# EAGLE design UmnitsaControl_v2.0 (EAGLE 9.3.0)
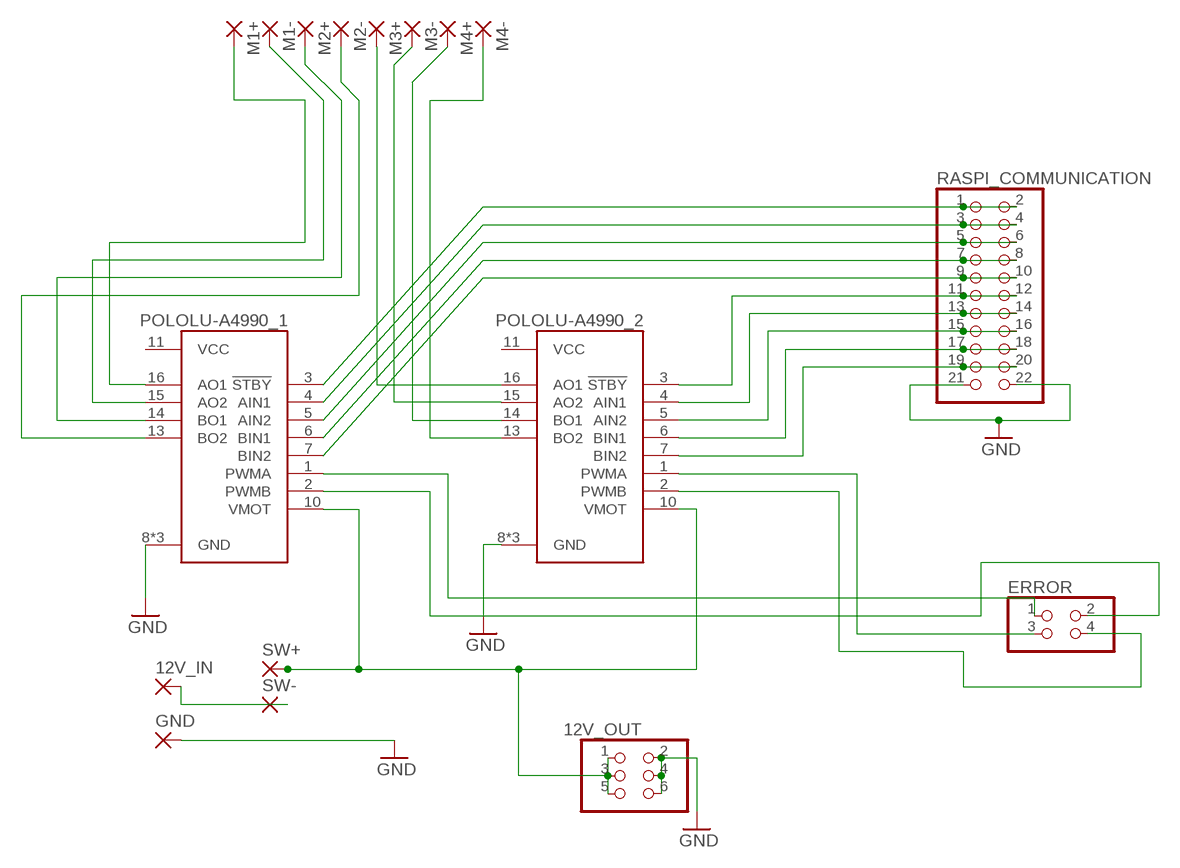
[diagram p0: schematic, sheet 1]

## Parts
12V_IN  3,81/1,4  [3,81/1,4]
12V_OUT  PINHD-2X3  [2X03]
ERROR  PINHD-2X2  [2X02]
GND  3,81/1,4  [3,81/1,4]
M1+  3,81/1,4  [3,81/1,4]
M1-  3,81/1,4  [3,81/1,4]
M2+  3,81/1,4  [3,81/1,4]
M2-  3,81/1,4  [3,81/1,4]
M3+  3,81/1,4  [3,81/1,4]
M3-  3,81/1,4  [3,81/1,4]
M4+  3,81/1,4  [3,81/1,4]
M4-  3,81/1,4  [3,81/1,4]
POLOLU-A4990_1  POLOLU-713  [SHIELD_POLOLU-713]
POLOLU-A4990_2  POLOLU-713  [SHIELD_POLOLU-713]
RASPI_COMMUNICATION  PINHD-2X11  [2X11]
SW+  2,54/1,0  [2,54/1,0]
SW-  2,54/1,0  [2,54/1,0]

## Nets
GND [Power]: 12V_OUT.2 12V_OUT.4 12V_OUT.6 GND.1(P) POLOLU-A4990_1.8(GND) POLOLU-A4990_1.9(GND) POLOLU-A4990_1.12(GND) POLOLU-A4990_2.8(GND) POLOLU-A4990_2.9(GND) POLOLU-A4990_2.12(GND) RASPI_COMMUNICATION.21 RASPI_COMMUNICATION.22
N$1 [Motor]: M1+.1(P) POLOLU-A4990_1.16(AO1)
N$2 [Motor]: M1-.1(P) POLOLU-A4990_1.15(AO2)
N$3: 12V_IN.1(P) SW-.1(P)
N$4 [Motor]: M2+.1(P) POLOLU-A4990_1.14(BO1)
N$5 [Motor]: M2-.1(P) POLOLU-A4990_1.13(BO2)
N$6 [Motor]: M3+.1(P) POLOLU-A4990_2.16(AO1)
N$7 [Motor]: M3-.1(P) POLOLU-A4990_2.15(AO2)
N$8 [Motor]: M4+.1(P) POLOLU-A4990_2.14(BO1)
N$9 [Motor]: M4-.1(P) POLOLU-A4990_2.13(BO2)
N$10: POLOLU-A4990_2.3(!STBY) RASPI_COMMUNICATION.11 RASPI_COMMUNICATION.12
N$11: POLOLU-A4990_2.7(BIN2) RASPI_COMMUNICATION.19 RASPI_COMMUNICATION.20
N$12: POLOLU-A4990_2.6(BIN1) RASPI_COMMUNICATION.17 RASPI_COMMUNICATION.18
N$13: POLOLU-A4990_2.5(AIN2) RASPI_COMMUNICATION.15 RASPI_COMMUNICATION.16
N$14: POLOLU-A4990_2.4(AIN1) RASPI_COMMUNICATION.13 RASPI_COMMUNICATION.14
N$15: POLOLU-A4990_1.3(!STBY) RASPI_COMMUNICATION.1 RASPI_COMMUNICATION.2
N$16: POLOLU-A4990_1.4(AIN1) RASPI_COMMUNICATION.3 RASPI_COMMUNICATION.4
N$17: POLOLU-A4990_1.5(AIN2) RASPI_COMMUNICATION.5 RASPI_COMMUNICATION.6
N$18: POLOLU-A4990_1.6(BIN1) RASPI_COMMUNICATION.7 RASPI_COMMUNICATION.8
N$19: POLOLU-A4990_1.7(BIN2) RASPI_COMMUNICATION.9 RASPI_COMMUNICATION.10
N$21: ERROR.3 POLOLU-A4990_2.1(PWMA)
N$23: ERROR.4 POLOLU-A4990_2.2(PWMB)
N$25: ERROR.1 POLOLU-A4990_1.1(PWMA)
N$26: ERROR.2 POLOLU-A4990_1.2(PWMB)
N$28 [Low Power]: 12V_OUT.1 12V_OUT.3 12V_OUT.5 POLOLU-A4990_1.10(VMOT) POLOLU-A4990_2.10(VMOT) SW+.1(P)

## Power pins joined to a net without a drawn wire
VCC: POLOLU-A4990_1.11(VCC) POLOLU-A4990_2.11(VCC)

## Library data of the parts
12V_IN GND M1+ M1- M2+ M2- M3+ M3- M4+ M4- = wirepad:3,81/1,4: THROUGH-HOLE PAD
12V_OUT = pinhead:PINHD-2X3: PIN HEADER
ERROR = pinhead:PINHD-2X2: PIN HEADER
POLOLU-A4990_1 POLOLU-A4990_2 = POLOLU-A4990:POLOLU-713: DC-motor driver; IC: TB6612FNG; 100kHz; 1A; Uin mot: 4.5; AVAILABILITY: Unavailable; DESCRIPTION: DC-motor driver; IC: TB6612FNG; 100kHz; 1A; Uin mot: 4.5; MF: Pololu; MP: POLOLU-713; PACKAGE: None; PRICE: None
RASPI_COMMUNICATION = pinhead:PINHD-2X11: PIN HEADER
SW+ SW- = wirepad:2,54/1,0: THROUGH-HOLE PAD

## Net classes
0 default: width 0.406 mm, clearance 0.406 mm
1 Power: width 3.048 mm, clearance 0.406 mm
2 Motor: width 1.016 mm, clearance 0.406 mm
3 Low Power: width 2.54 mm, clearance 0.406 mm

## Board
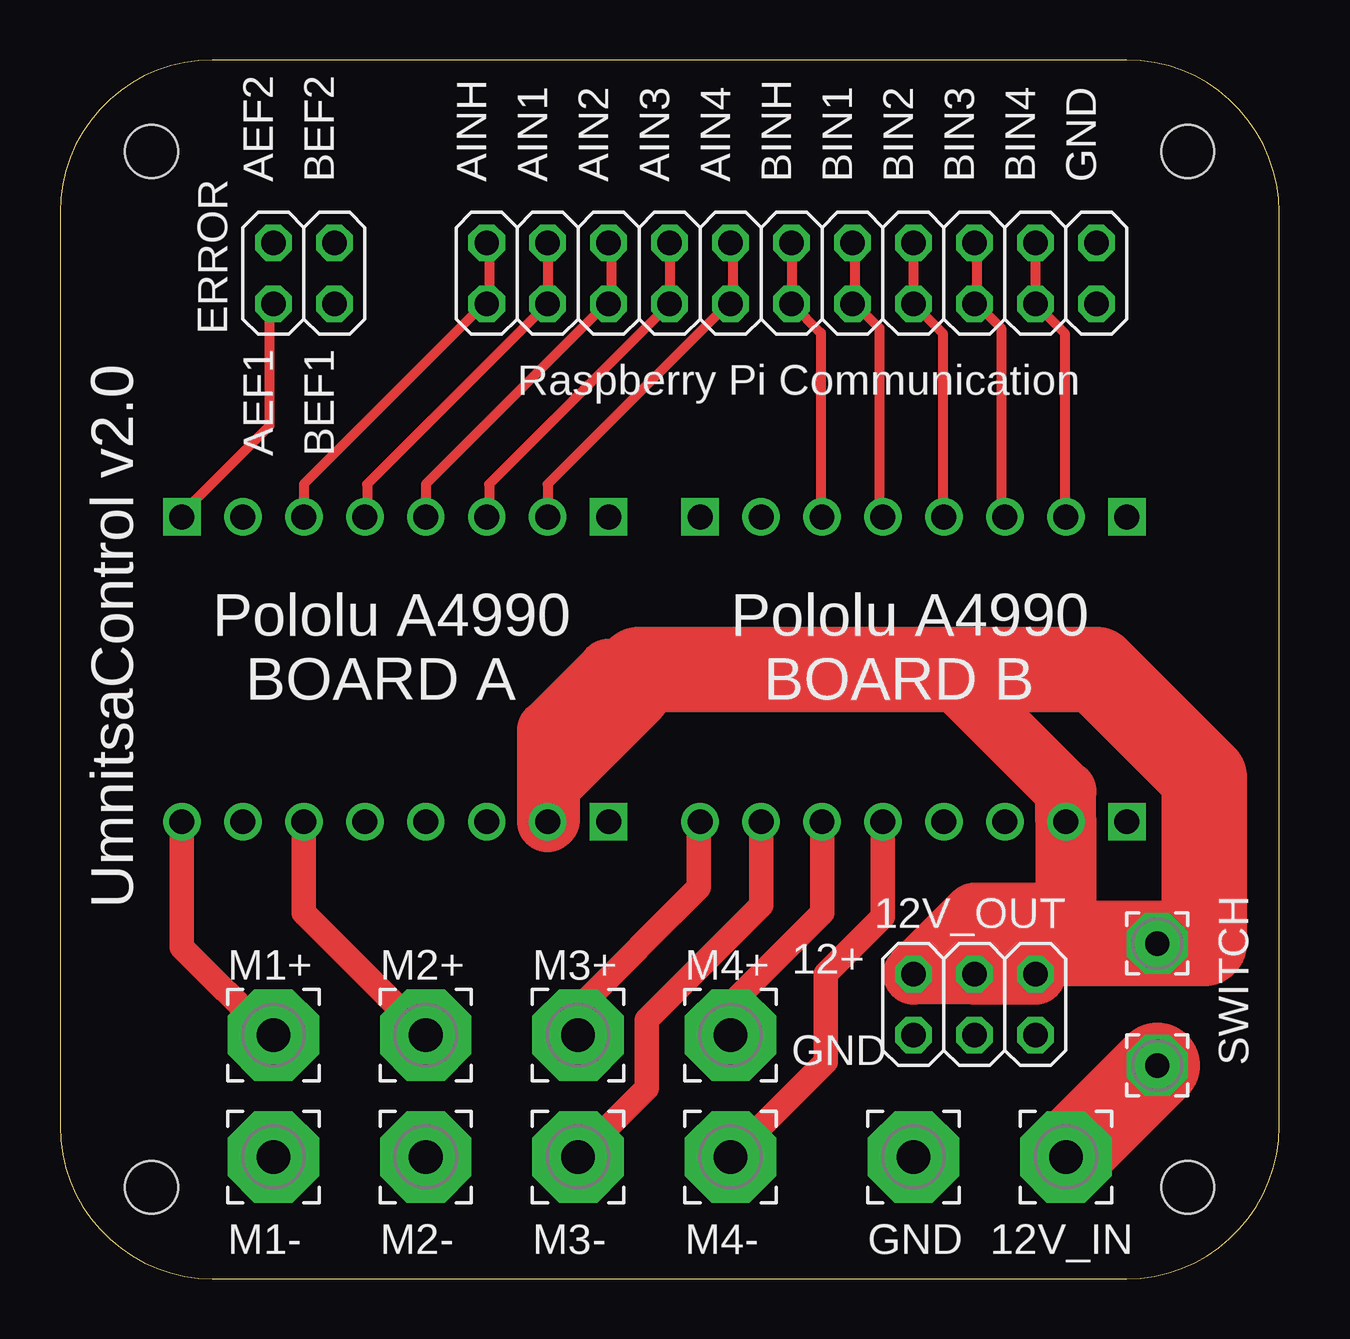
[diagram p1: board, top side]
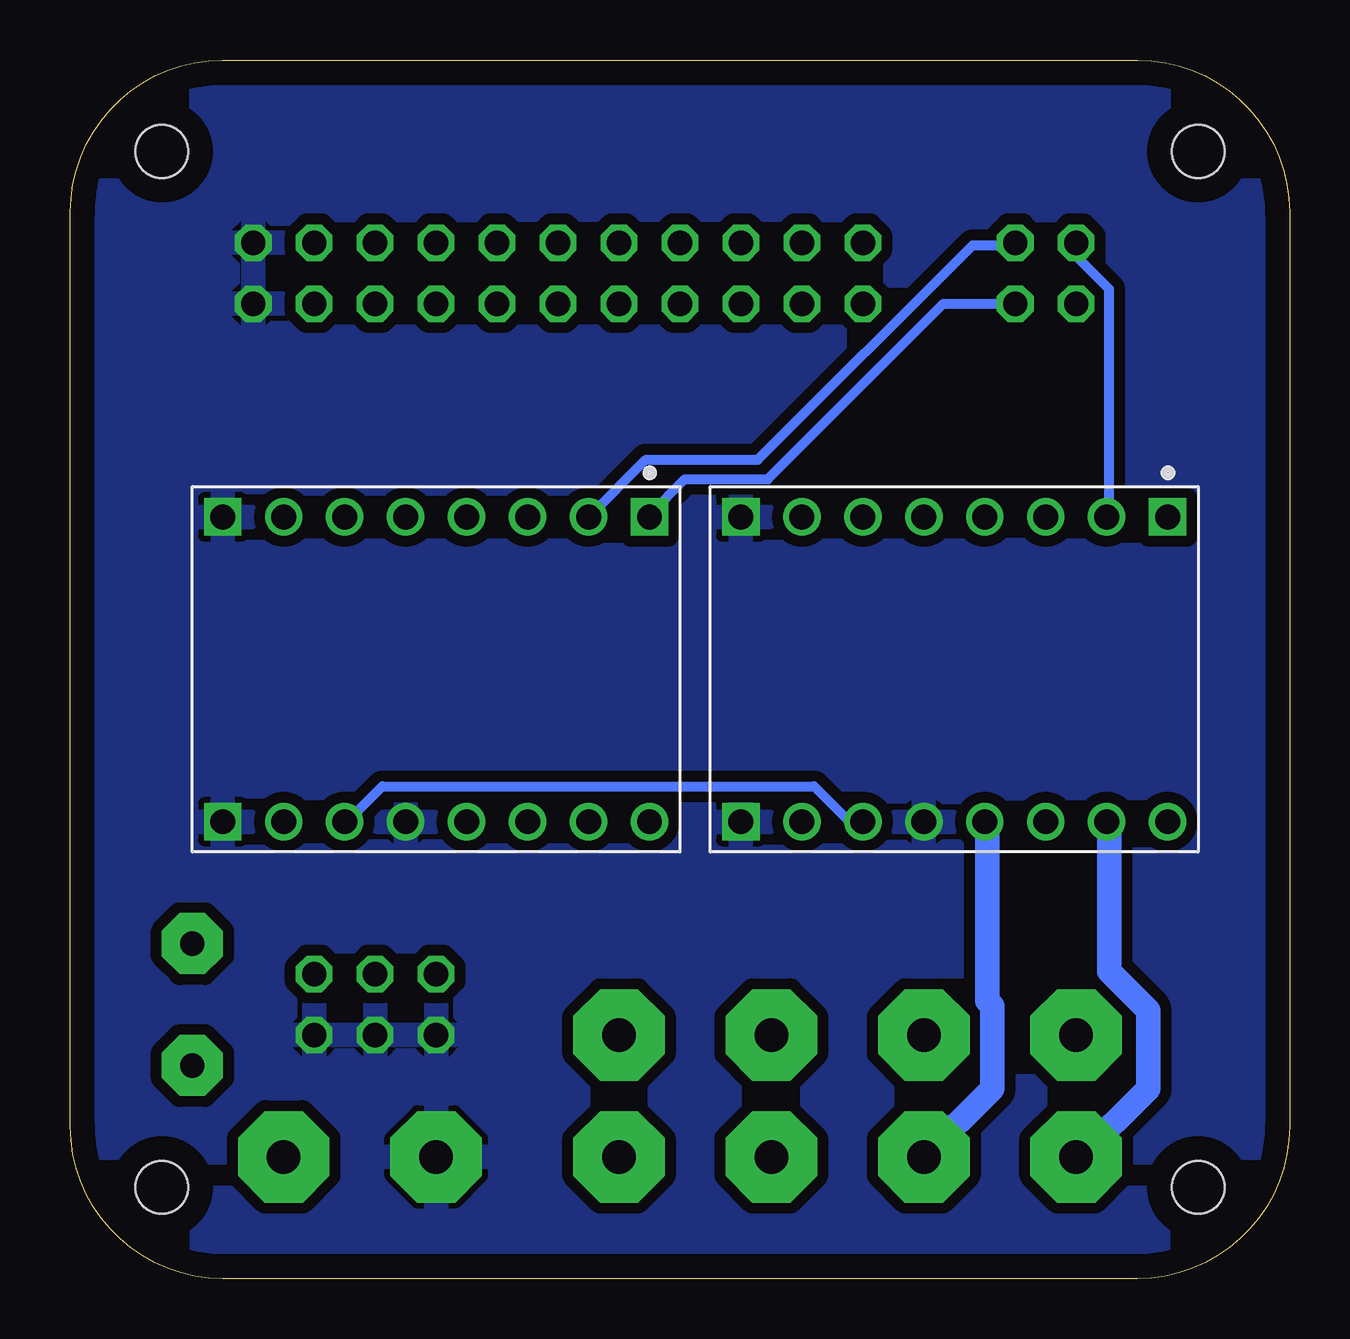
[diagram p2: board, bottom side, seen from below]

Size 50.8 x 50.8 mm. Coordinates in mm from the lower left corner, seen from the top.
Outline: 0,44.45 0,6.35 arc90 6.35,0 44.45,0 arc90 50.8,6.35 50.8,44.45 arc90 44.45,50.8 6.35,50.8 arc90 0,44.45
Copper layers (1*16): Top 0.035mm / dielectric 1.5mm / Bottom 0.035mm
Design rules "default": minimum track width 6mil, minimum drill 0.35mm, track to track 6mil, track to pad 6mil, pad to pad 6mil, via to via 6mil, smd to smd 6mil, copper to edge 40mil, drill to drill 6mil, minimum pad ring 10mil, minimum via ring 8mil, stop-mask expansion 4mil, vias tented up to drill 0mil, thermal gap 10mil
Holes 2.2 mm at 3.81,46.99 3.81,3.81 46.99,46.99 46.99,3.81

### Footprints (pad centres in the part's own frame; a part is rotated, then mirrored left to right if it is on the bottom)
3,81/1,4 = drill 1.397 pad 3.81 octagon: 1 0,0
2X03 = drill 1.016 octagon: 1 -2.54,-1.27; 2 -2.54,1.27; 3 0,-1.27; 4 0,1.27; 5 2.54,-1.27; 6 2.54,1.27
2X02 = drill 1.016 octagon: 1 -1.27,-1.27; 2 -1.27,1.27; 3 1.27,-1.27; 4 1.27,1.27
SHIELD_POLOLU-713 = drill 1.04 square: 1 -6.35,8.89; 8 -6.35,-8.89; 9 6.35,-8.89 | drill 1.04: 2 -6.35,6.35; 3 -6.35,3.81; 4 -6.35,1.27; 5 -6.35,-1.27; 6 -6.35,-3.81; 7 -6.35,-6.35; 10 6.35,-6.35; 11 6.35,-3.81; 12 6.35,-1.27; 13 6.35,1.27; 14 6.35,3.81; 15 6.35,6.35; 16 6.35,8.89
2X11 = drill 1.016 octagon: 1 -12.7,-1.27; 2 -12.7,1.27; 3 -10.16,-1.27; 4 -10.16,1.27; 5 -7.62,-1.27; 6 -7.62,1.27; 7 -5.08,-1.27; 8 -5.08,1.27; 9 -2.54,-1.27; 10 -2.54,1.27; 11 0,-1.27; 12 0,1.27; 13 2.54,-1.27; 14 2.54,1.27; 15 5.08,-1.27; 16 5.08,1.27; 17 7.62,-1.27; 18 7.62,1.27; 19 10.16,-1.27; 20 10.16,1.27; 21 12.7,-1.27; 22 12.7,1.27
2,54/1,0 = drill 1.016 pad 2.54 octagon: 1 0,0

### Placement (x,y rotation side)
12V_IN  41.91,5.08 0 top
12V_OUT  38.1,11.43 180 top
ERROR  10.16,41.91 0 top
GND  35.56,5.08 0 top
M1+  8.89,10.16 0 top
M1-  8.89,5.08 0 top
M2+  15.24,10.16 0 top
M2-  15.24,5.08 0 top
M3+  21.59,10.16 0 top
M3-  21.59,5.08 0 top
M4+  27.94,10.16 0 top
M4-  27.94,5.08 0 top
POLOLU-A4990_1  13.97,25.4 270 bottom
POLOLU-A4990_2  35.56,25.4 270 bottom
RASPI_COMMUNICATION  30.48,41.91 0 top
SW+  45.72,13.97 0 top
SW-  45.72,8.89 0 top

### Tracks (layer width: path | path; a pad name or v marks a point on that pad's centre or on a via)
GND
  pour Bottom (isolate 0.457): 6.35,50.8 44.45,50.8 arc-90 50.8,44.45 50.8,6.35 arc-90 44.45,0 6.35,0 arc-90 0,6.35 0,44.45 arc-90
N$1
  Top 1.016: POLOLU-A4990_1.16 5.08,13.82 8.74,10.16 M1+.1
N$2
  Bottom 1.016: POLOLU-A4990_1.15 7.52,18.9 7.52,12.8 5.89,11.18 5.89,7.92 8.74,5.08 M1-.1
N$3
  Top 3.556: SW-.1 12V_IN.1
N$4
  Top 1.016: POLOLU-A4990_1.14 10.16,15.24 M2+.1
N$5
  Bottom 1.016: M2-.1 12.39,7.92 12.39,11.38 12.6,11.58 12.6,18.9 POLOLU-A4990_1.13
N$6
  Top 1.016: M3+.1 21.59,11.28 26.62,16.31 26.62,18.9 POLOLU-A4990_2.16
N$7
  Top 1.016: POLOLU-A4990_2.15 29.21,15.56 24.45,10.79 24.45,7.94 M3-.1
N$8
  Top 1.016: POLOLU-A4990_2.14 31.75,15.24 27.94,11.43 M4+.1
N$9
  Top 1.016: POLOLU-A4990_2.13 34.29,15.08 31.91,12.7 31.91,9.05 M4-.1
N$10
  Top 0.406: RASPI_COMMUNICATION.12 RASPI_COMMUNICATION.11 31.7,39.42 31.7,31.9 POLOLU-A4990_2.3
N$11
  Top 0.406: RASPI_COMMUNICATION.20 RASPI_COMMUNICATION.19 41.86,39.42 41.86,31.9 POLOLU-A4990_2.7
N$12
  Top 0.406: 38.2,40.64 38.2,43.08 RASPI_COMMUNICATION.18 | 38.2,40.64 39.22,39.62 39.22,31.9 POLOLU-A4990_2.6 | 38.2,40.64 RASPI_COMMUNICATION.17
N$13
  Top 0.406: RASPI_COMMUNICATION.16 RASPI_COMMUNICATION.15 36.78,39.42 36.78,31.9 POLOLU-A4990_2.5
N$14
  Top 0.406: 33.12,40.64 33.12,43.08 RASPI_COMMUNICATION.14 | 33.12,40.64 34.14,39.62 34.14,31.9 POLOLU-A4990_2.4 | 33.12,40.64 RASPI_COMMUNICATION.13
N$15
  Top 0.406: RASPI_COMMUNICATION.2 17.88,43.08 17.88,40.64 RASPI_COMMUNICATION.1 17.68,40.64 10.16,33.12 POLOLU-A4990_1.3
N$16
  Top 0.406: RASPI_COMMUNICATION.4 RASPI_COMMUNICATION.3 12.8,33.12 12.8,31.9 POLOLU-A4990_1.4
N$17
  Top 0.406: RASPI_COMMUNICATION.6 22.96,43.08 22.96,40.64 RASPI_COMMUNICATION.5 22.76,40.64 15.24,33.12 POLOLU-A4990_1.5
N$18
  Top 0.406: RASPI_COMMUNICATION.8 RASPI_COMMUNICATION.7 17.88,33.12 17.88,31.9 POLOLU-A4990_1.6
N$19
  Top 0.406: RASPI_COMMUNICATION.10 28.04,43.08 28.04,40.64 RASPI_COMMUNICATION.9 27.84,40.64 20.32,33.12 POLOLU-A4990_1.7
N$21
  Bottom 0.406: ERROR.3 14.43,40.64 21.74,33.33 25.2,33.33 26.62,31.9 POLOLU-A4990_2.1
N$23
  Bottom 0.406: POLOLU-A4990_2.2 26.82,34.14 22.15,34.14 13.21,43.08 11.58,43.08 ERROR.4
N$25
  Top 0.406: ERROR.1 8.74,40.64 8.74,35.56 5.08,31.9 POLOLU-A4990_1.1
N$26
  Bottom 0.406: ERROR.2 8.74,43.08 8.74,42.47 7.52,41.25 7.52,31.9 POLOLU-A4990_1.2
N$28
  Top 2.54: 36.83,25.4 41.91,20.32 POLOLU-A4990_2.10 41.91,15.24 | 12V_OUT.3 12V_OUT.5 | 12V_OUT.3 12V_OUT.1 12V_OUT.5 | 12V_OUT.3 38.1,15.24 | 38.1,15.24 41.91,15.24 | 12V_OUT.5 38.1,15.24 | 41.91,15.24 41.91,13.97 | POLOLU-A4990_1.10 20.32,22.86 22.86,25.4 24.13,25.4 24.13,24.25 20.4,20.52 20.4,19.13 POLOLU-A4990_1.10
  Top 3.556: 24.13,25.4 36.83,25.4 43.18,25.4 47.68,20.9 47.68,13.97 SW+.1 41.91,13.97
VCC
  Bottom 0.406: POLOLU-A4990_1.11 17.78,19.1 18.39,19.1 19.81,20.52 37.8,20.52 39.22,19.1 POLOLU-A4990_2.11

### Text on the board
tNames: AEF2 | BEF2 | AINH | AIN1 | AIN2 | AIN3 | AIN4 | BINH | BIN1 | BIN2 | BIN3 | BIN4 | GND | UmnitsaControl v2.0 | Raspberry Pi Communication | AEF1 | BEF1 | Pololu A4990 / BOARD A | Pololu A4990 / BOARD B | 12+ | GND | SWITCH